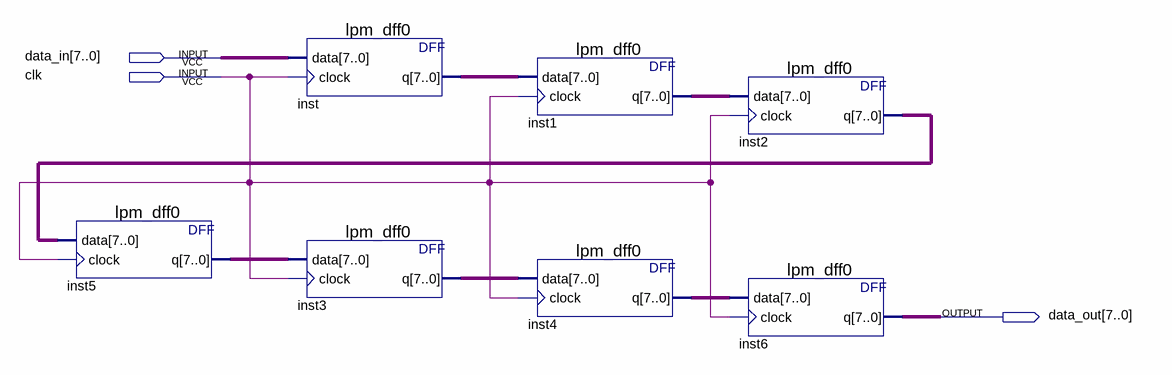
[diagram p0: schematic sheet]
// Quartus schematic buffer.bdf as structural Verilog: 7 symbols, 3 pins
module buffer (
  input  [7:0] data_in,
  input  clk,
  output [7:0] data_out
);

  wire [7:0] inst1_q, inst2_q, inst3_q, inst4_q, inst5_q, inst_q;

  lpm_dff0 inst5 (.data(inst2_q), .clock(clk), .q(inst5_q));
  lpm_dff0 inst (.data(data_in), .clock(clk), .q(inst_q));
  lpm_dff0 inst3 (.data(inst5_q), .clock(clk), .q(inst3_q));
  lpm_dff0 inst1 (.data(inst_q), .clock(clk), .q(inst1_q));
  lpm_dff0 inst4 (.data(inst3_q), .clock(clk), .q(inst4_q));
  lpm_dff0 inst2 (.data(inst1_q), .clock(clk), .q(inst2_q));
  lpm_dff0 inst6 (.data(inst4_q), .clock(clk), .q(data_out));
endmodule
